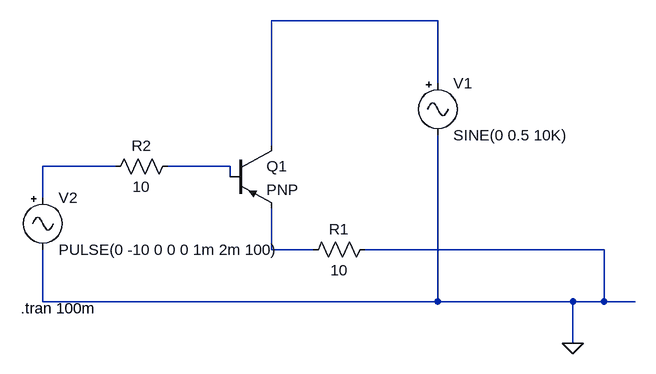
[diagram p0: schematic ASK modulator.asc]
ASK modulator.asc, the LTspice schematic file:
Version 4
SHEET 1 880 680
WIRE 496 -80 240 -80
WIRE 496 16 496 -80
WIRE 240 112 240 -80
WIRE 0 144 -112 144
WIRE 176 144 80 144
WIRE 176 160 176 144
WIRE -112 192 -112 144
WIRE 240 272 240 208
WIRE 304 272 240 272
WIRE 752 272 384 272
WIRE -112 352 -112 272
WIRE 496 352 496 96
WIRE 496 352 -112 352
WIRE 704 352 496 352
WIRE 752 352 752 272
WIRE 752 352 704 352
WIRE 800 352 752 352
WIRE 704 416 704 352
FLAG 704 416 0
SYMBOL pnp 176 112 R0
SYMATTR InstName Q1
SYMBOL res 96 128 R90
WINDOW 0 0 56 VBottom 2
WINDOW 3 32 56 VTop 2
SYMATTR InstName R2
SYMATTR Value 10
SYMBOL Misc\\signal 496 0 R0
WINDOW 123 0 0 Left 0
WINDOW 39 0 0 Left 0
SYMATTR InstName V1
SYMATTR Value SINE(0 0.5 10K)
SYMBOL Misc\\signal -112 176 R0
WINDOW 123 0 0 Left 0
WINDOW 39 0 0 Left 0
SYMATTR InstName V2
SYMATTR Value PULSE(0 -10 0 0 0 1m 2m 100)
SYMBOL res 400 256 R90
WINDOW 0 0 56 VBottom 2
WINDOW 3 32 56 VTop 2
SYMATTR InstName R1
SYMATTR Value 10
TEXT -146 362 Left 2 !.tran 100m

The netlist it stands for:
* ASK modulator.asc
Q1 N001 N003 N004 0 PNP
R2 N003 N002 10
V1 N001 0 SINE(0 0.5 10K)
V2 N002 0 PULSE(0 -10 0 0 0 1m 2m 100)
R1 0 N004 10
.model NPN NPN
.model PNP PNP
.lib standard.bjt
.tran 100m
.backanno
.end